# EAGLE schematic fmc (EAGLE 7.5.0)
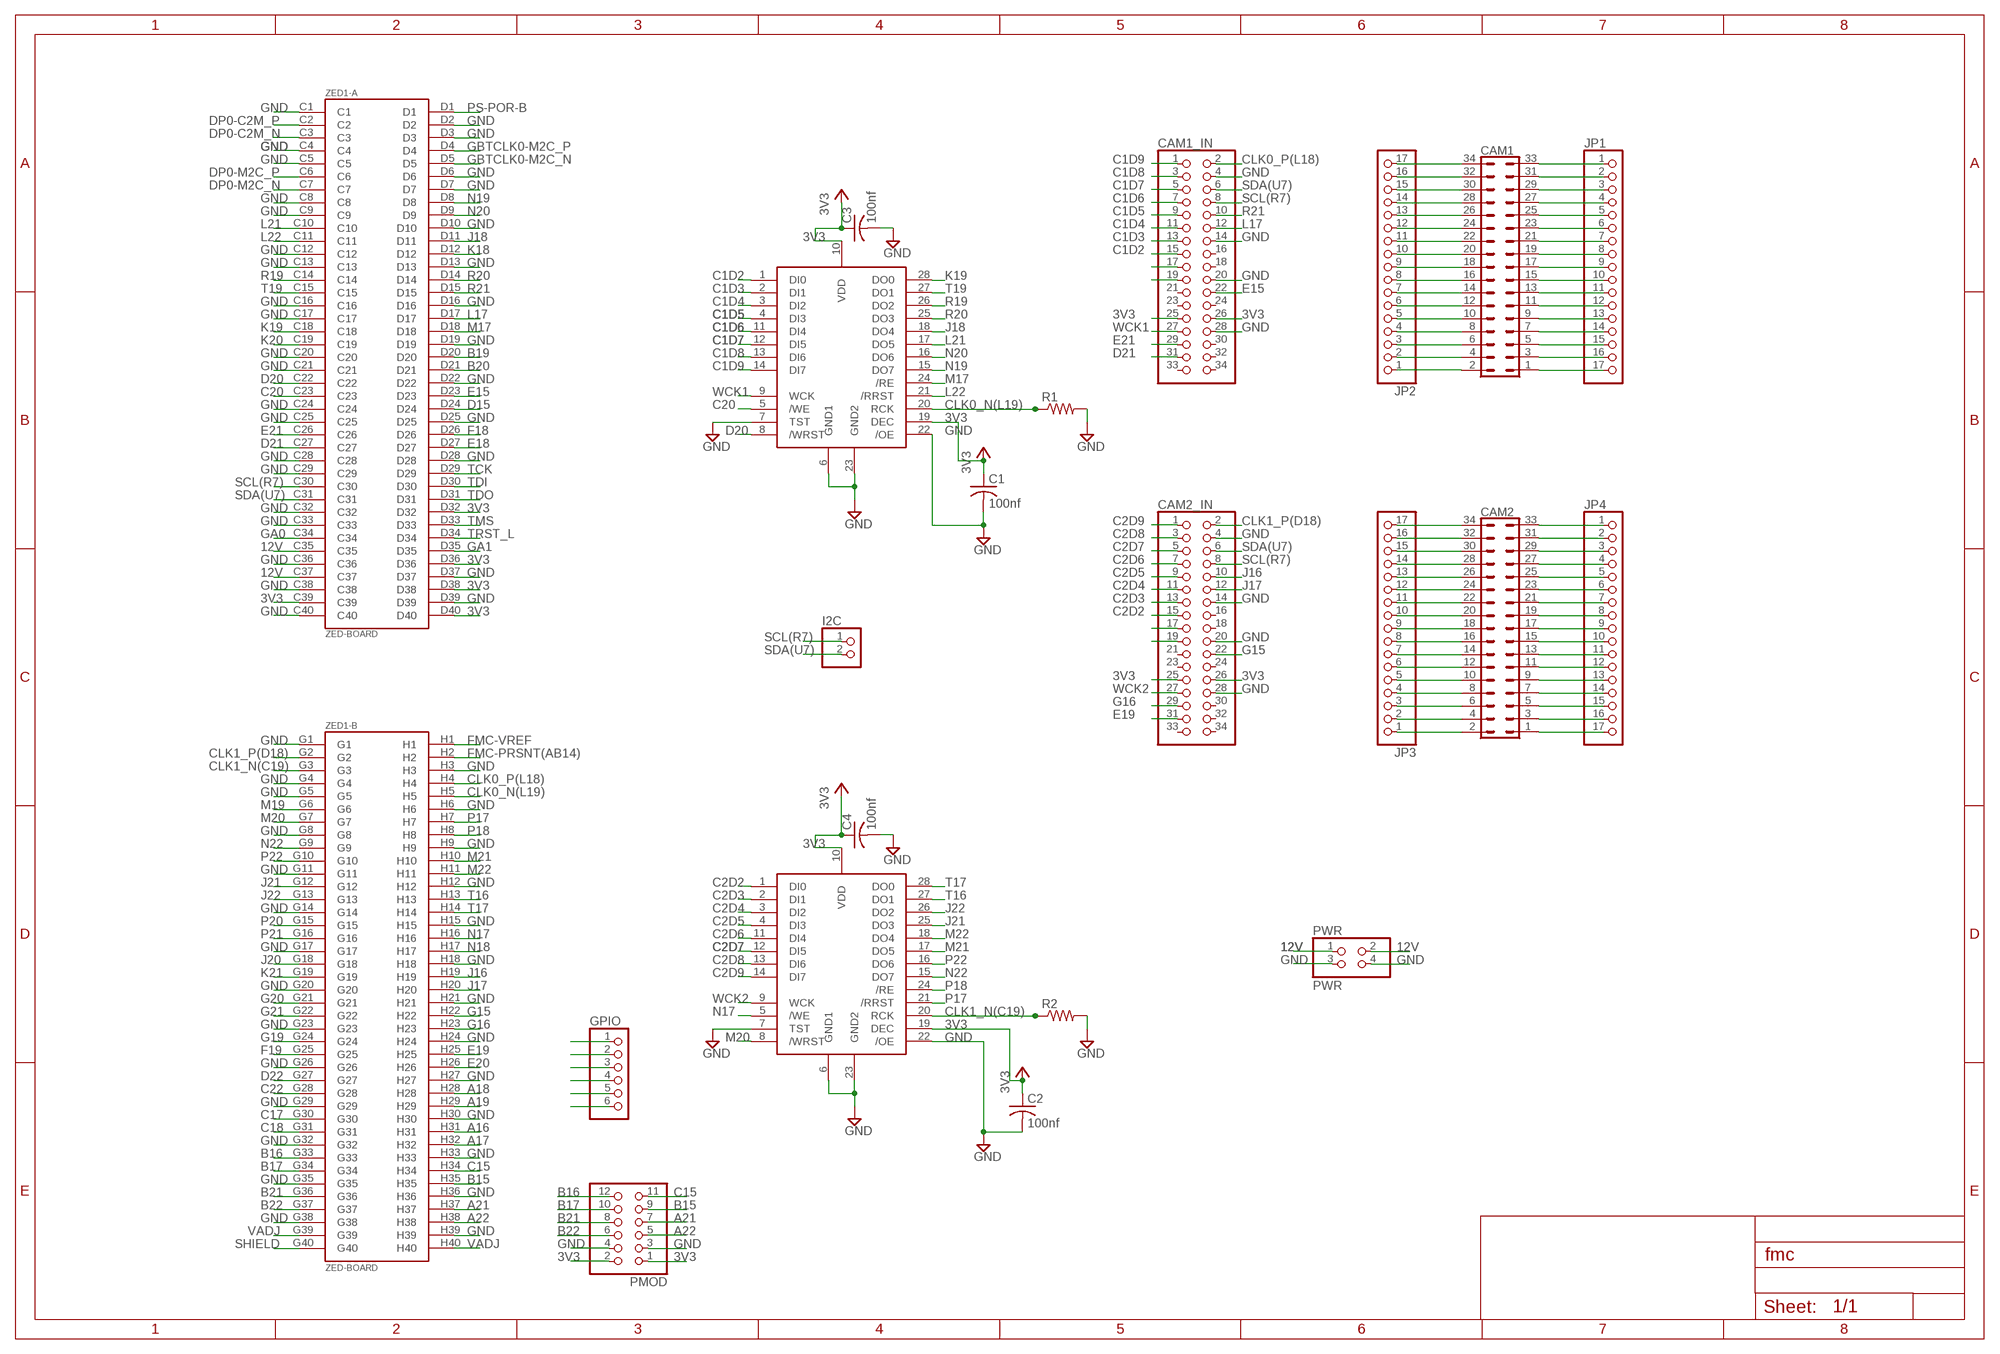
[diagram p0: schematic, sheet 1]

## Parts
AL422B_2  CAM2_FIFO  AL422B  [SOP28]
ALA22B_1  CAM1_FIFO  AL422B  [SOP28]
C1  100nf  C-US025-024X044  [C025-024X044]
C2  100nf  C-US025-024X044  [C025-024X044]
C3  100nf  C-US025-024X044  [C025-024X044]
C4  100nf  C-US025-024X044  [C025-024X044]
CAM1  PHB_1MM27_2X17_SNT  [PHB_1MM27_2X17_SNT]
CAM1_IN  PINHD-2X17  [2X17]
CAM2  PHB_1MM27_2X17_SNT  [PHB_1MM27_2X17_SNT]
CAM2_IN  PINHD-2X17  [2X17]
GPIO  PINHD-1X6  [1X06]
I2C  PINHD-1X2  [1X02]
JP1  PINHD-1X17  [1X17]
JP2  PINHD-1X17  [1X17]
JP3  PINHD-1X17  [1X17]
JP4  PINHD-1X17  [1X17]
PMOD  PINHD-2X6  [2X06]
PWR  PWR  PINHD-2X2  [2X02]
R1  R-US_M0805  [M0805]
R2  R-US_M0805  [M0805]
ZED1  ZED-BOARD  [ASP-134604-01]

## Nets
3V3: AL422B_2.10(VDD) AL422B_2.19(DEC) ALA22B_1.10(VDD) ALA22B_1.19(DEC) C1.1 C2.1 C3.1 C4.1 CAM1_IN.25 CAM1_IN.26 CAM2_IN.25 CAM2_IN.26 GPIO.6 PMOD.1 PMOD.2 ZED1.C39(-A:C39) ZED1.D32(-A:D32) ZED1.D36(-A:D36) ZED1.D38(-A:D38) ZED1.D40(-A:D40)
12V: PWR.1 PWR.2 ZED1.C35(-A:C35) ZED1.C37(-A:C37)
A16: GPIO.3 ZED1.H31(-B:H31)
A17: GPIO.4 ZED1.H32(-B:H32)
A18: GPIO.1 ZED1.H28(-B:H28)
A19: GPIO.2 ZED1.H29(-B:H29)
A21: PMOD.7 ZED1.H37(-B:H37)
A22: PMOD.5 ZED1.H38(-B:H38)
B15: PMOD.9 ZED1.H35(-B:H35)
B16: PMOD.12 ZED1.G33(-B:G33)
B17: PMOD.10 ZED1.G34(-B:G34)
B19: ZED1.D20(-A:D20)
B20: ZED1.D21(-A:D21)
B21: PMOD.8 ZED1.G36(-B:G36)
B22: PMOD.6 ZED1.G37(-B:G37)
C1D2: ALA22B_1.1(DI0) CAM1_IN.15
C1D3: ALA22B_1.2(DI1) CAM1_IN.13
C1D4: ALA22B_1.3(DI2) CAM1_IN.11
C1D5: ALA22B_1.4(DI3) CAM1_IN.9
C1D6: ALA22B_1.11(DI4) CAM1_IN.7
C1D7: ALA22B_1.12(DI5) CAM1_IN.5
C1D8: ALA22B_1.13(DI6) CAM1_IN.3
C1D9: ALA22B_1.14(DI7) CAM1_IN.1
C2D2: AL422B_2.1(DI0) CAM2_IN.15
C2D3: AL422B_2.2(DI1) CAM2_IN.13
C2D4: AL422B_2.3(DI2) CAM2_IN.11
C2D5: AL422B_2.4(DI3) CAM2_IN.9
C2D6: AL422B_2.11(DI4) CAM2_IN.7
C2D7: AL422B_2.12(DI5) CAM2_IN.5
C2D8: AL422B_2.13(DI6) CAM2_IN.3
C2D9: AL422B_2.14(DI7) CAM2_IN.1
C15: PMOD.11 ZED1.H34(-B:H34)
C17: ZED1.G30(-B:G30)
C18: ZED1.G31(-B:G31)
C20: ALA22B_1.5(/WE) ZED1.C23(-A:C23)
C22: ZED1.G28(-B:G28)
CLK0_N(L19): ALA22B_1.20(RCK) R1.1 ZED1.H5(-B:H5)
CLK0_P(L18): CAM1_IN.2 ZED1.H4(-B:H4)
CLK1_N(C19): AL422B_2.20(RCK) R2.1 ZED1.G3(-B:G3)
CLK1_P(D18): CAM2_IN.2 ZED1.G2(-B:G2)
D15: ZED1.D24(-A:D24)
D20: ALA22B_1.8(/WRST) ZED1.C22(-A:C22)
D21: CAM1_IN.31 ZED1.C27(-A:C27)
D22: ZED1.G27(-B:G27)
DP0-C2M_N: ZED1.C3(-A:C3)
DP0-C2M_P: ZED1.C2(-A:C2)
DP0-M2C_N: ZED1.C7(-A:C7)
DP0-M2C_P: ZED1.C6(-A:C6)
E15: CAM1_IN.22 ZED1.D23(-A:D23)
E18: ZED1.D27(-A:D27)
E19: CAM2_IN.31 ZED1.H25(-B:H25)
E20: ZED1.H26(-B:H26)
E21: CAM1_IN.29 ZED1.C26(-A:C26)
F18: ZED1.D26(-A:D26)
F19: ZED1.G25(-B:G25)
FMC-PRSNT(AB14): ZED1.H2(-B:H2)
FMC-VREF: ZED1.H1(-B:H1)
G15: CAM2_IN.22 ZED1.H22(-B:H22)
G16: CAM2_IN.29 ZED1.H23(-B:H23)
G19: ZED1.G24(-B:G24)
G20: ZED1.G21(-B:G21)
G21: ZED1.G22(-B:G22)
GA0: ZED1.C34(-A:C34)
GA1: ZED1.D35(-A:D35)
GBTCLK0-M2C_N: ZED1.D5(-A:D5)
GBTCLK0-M2C_P: ZED1.D4(-A:D4)
GND: AL422B_2.6(GND1) AL422B_2.7(TST) AL422B_2.22(/OE) AL422B_2.23(GND2) ALA22B_1.6(GND1) ALA22B_1.7(TST) ALA22B_1.22(/OE) ALA22B_1.23(GND2) C1.2 C2.2 C3.2 C4.2 CAM1_IN.4 CAM1_IN.14 CAM1_IN.20 CAM1_IN.28 CAM2_IN.4 CAM2_IN.14 CAM2_IN.20 CAM2_IN.28 GPIO.5 PMOD.3 PMOD.4 PWR.3 PWR.4 R1.2 R2.2 ZED1.C1(-A:C1) ZED1.C4(-A:C4) ZED1.C5(-A:C5) ZED1.C8(-A:C8) ZED1.C9(-A:C9) ZED1.C12(-A:C12) ZED1.C13(-A:C13) ZED1.C16(-A:C16) ZED1.C17(-A:C17) ZED1.C20(-A:C20) ZED1.C21(-A:C21) ZED1.C24(-A:C24) ZED1.C25(-A:C25) ZED1.C28(-A:C28) ZED1.C29(-A:C29) ZED1.C32(-A:C32) ZED1.C33(-A:C33) ZED1.C36(-A:C36) ZED1.C38(-A:C38) ZED1.C40(-A:C40) ZED1.D2(-A:D2) ZED1.D3(-A:D3) ZED1.D6(-A:D6) ZED1.D7(-A:D7) ZED1.D10(-A:D10) ZED1.D13(-A:D13) ZED1.D16(-A:D16) ZED1.D19(-A:D19) ZED1.D22(-A:D22) ZED1.D25(-A:D25) ZED1.D28(-A:D28) ZED1.D37(-A:D37) ZED1.D39(-A:D39) ZED1.G1(-B:G1) ZED1.G4(-B:G4) ZED1.G5(-B:G5) ZED1.G8(-B:G8) ZED1.G11(-B:G11) ZED1.G14(-B:G14) ZED1.G17(-B:G17) ZED1.G20(-B:G20) ZED1.G23(-B:G23) ZED1.G26(-B:G26) ZED1.G29(-B:G29) ZED1.G32(-B:G32) ZED1.G35(-B:G35) ZED1.G38(-B:G38) ZED1.H3(-B:H3) ZED1.H6(-B:H6) ZED1.H9(-B:H9) ZED1.H12(-B:H12) ZED1.H15(-B:H15) ZED1.H18(-B:H18) ZED1.H21(-B:H21) ZED1.H24(-B:H24) ZED1.H27(-B:H27) ZED1.H30(-B:H30) ZED1.H33(-B:H33) ZED1.H36(-B:H36) ZED1.H39(-B:H39)
J16: CAM2_IN.10 ZED1.H19(-B:H19)
J17: CAM2_IN.12 ZED1.H20(-B:H20)
J18: ALA22B_1.18(DO4) ZED1.D11(-A:D11)
J20: ZED1.G18(-B:G18)
J21: AL422B_2.25(DO3) ZED1.G12(-B:G12)
J22: AL422B_2.26(DO2) ZED1.G13(-B:G13)
K18: ZED1.D12(-A:D12)
K19: ALA22B_1.28(DO0) ZED1.C18(-A:C18)
K20: ZED1.C19(-A:C19)
K21: ZED1.G19(-B:G19)
L17: CAM1_IN.12 ZED1.D17(-A:D17)
L21: ALA22B_1.17(DO5) ZED1.C10(-A:C10)
L22: ALA22B_1.21(/RRST) ZED1.C11(-A:C11)
M17: ALA22B_1.24(/RE) ZED1.D18(-A:D18)
M19: ZED1.G6(-B:G6)
M20: AL422B_2.8(/WRST) ZED1.G7(-B:G7)
M21: AL422B_2.17(DO5) ZED1.H10(-B:H10)
M22: AL422B_2.18(DO4) ZED1.H11(-B:H11)
N17: AL422B_2.5(/WE) ZED1.H16(-B:H16)
N18: ZED1.H17(-B:H17)
N19: ALA22B_1.15(DO7) ZED1.D8(-A:D8)
N20: ALA22B_1.16(DO6) ZED1.D9(-A:D9)
N22: AL422B_2.15(DO7) ZED1.G9(-B:G9)
N$1: CAM1.34 JP2.17
N$2: CAM1.32 JP2.16
N$3: CAM1.30 JP2.15
N$4: CAM1.28 JP2.14
N$5: CAM1.26 JP2.13
N$6: CAM1.24 JP2.12
N$7: CAM1.22 JP2.11
N$8: CAM1.20 JP2.10
N$9: CAM1.18 JP2.9
N$10: CAM1.16 JP2.8
N$11: CAM1.14 JP2.7
N$12: CAM1.12 JP2.6
N$13: CAM1.10 JP2.5
N$14: CAM1.8 JP2.4
N$15: CAM1.6 JP2.3
N$16: CAM1.4 JP2.2
N$17: CAM1.2 JP2.1
N$18: CAM1.33 JP1.1
N$19: CAM1.31 JP1.2
N$21: CAM1.29 JP1.3
N$22: CAM1.27 JP1.4
N$23: CAM1.25 JP1.5
N$24: CAM1.23 JP1.6
N$25: CAM1.21 JP1.7
N$26: CAM1.19 JP1.8
N$27: CAM1.17 JP1.9
N$28: CAM1.15 JP1.10
N$29: CAM1.13 JP1.11
N$30: CAM1.11 JP1.12
N$31: CAM1.9 JP1.13
N$32: CAM1.7 JP1.14
N$33: CAM1.5 JP1.15
N$34: CAM1.3 JP1.16
N$35: CAM1.1 JP1.17
N$36: CAM2.33 JP4.1
N$37: CAM2.31 JP4.2
N$38: CAM2.29 JP4.3
N$39: CAM2.27 JP4.4
N$40: CAM2.25 JP4.5
N$41: CAM2.23 JP4.6
N$42: CAM2.21 JP4.7
N$43: CAM2.19 JP4.8
N$44: CAM2.17 JP4.9
N$45: CAM2.15 JP4.10
N$46: CAM2.13 JP4.11
N$47: CAM2.11 JP4.12
N$48: CAM2.9 JP4.13
N$49: CAM2.7 JP4.14
N$50: CAM2.5 JP4.15
N$51: CAM2.3 JP4.16
N$52: CAM2.1 JP4.17
N$53: CAM2.34 JP3.17
N$54: CAM2.32 JP3.16
N$55: CAM2.30 JP3.15
N$56: CAM2.28 JP3.14
N$57: CAM2.26 JP3.13
N$58: CAM2.24 JP3.12
N$59: CAM2.22 JP3.11
N$60: CAM2.20 JP3.10
N$61: CAM2.18 JP3.9
N$62: CAM2.16 JP3.8
N$63: CAM2.14 JP3.7
N$64: CAM2.12 JP3.6
N$65: CAM2.10 JP3.5
N$66: CAM2.8 JP3.4
N$67: CAM2.6 JP3.3
N$68: CAM2.4 JP3.2
N$69: CAM2.2 JP3.1
N$94: CAM1_IN.19
N$95: CAM1_IN.17
N$128: CAM2_IN.19
N$129: CAM2_IN.17
P17: AL422B_2.21(/RRST) ZED1.H7(-B:H7)
P18: AL422B_2.24(/RE) ZED1.H8(-B:H8)
P20: ZED1.G15(-B:G15)
P21: ZED1.G16(-B:G16)
P22: AL422B_2.16(DO6) ZED1.G10(-B:G10)
PS-POR-B: ZED1.D1(-A:D1)
R19: ALA22B_1.26(DO2) ZED1.C14(-A:C14)
R20: ALA22B_1.25(DO3) ZED1.D14(-A:D14)
R21: CAM1_IN.10 ZED1.D15(-A:D15)
SCL(R7): CAM1_IN.8 CAM2_IN.8 I2C.1 ZED1.C30(-A:C30)
SDA(U7): CAM1_IN.6 CAM2_IN.6 I2C.2 ZED1.C31(-A:C31)
SHIELD: ZED1.G40(-B:G40)
T16: AL422B_2.27(DO1) ZED1.H13(-B:H13)
T17: AL422B_2.28(DO0) ZED1.H14(-B:H14)
T19: ALA22B_1.27(DO1) ZED1.C15(-A:C15)
TCK: ZED1.D29(-A:D29)
TDI: ZED1.D30(-A:D30)
TDO: ZED1.D31(-A:D31)
TMS: ZED1.D33(-A:D33)
TRST_L: ZED1.D34(-A:D34)
VADJ: ZED1.G39(-B:G39) ZED1.H40(-B:H40)
WCK1: ALA22B_1.9(WCK) CAM1_IN.27
WCK2: AL422B_2.9(WCK) CAM2_IN.27
Unconnected: CAM1_IN.16 CAM1_IN.18 CAM1_IN.21 CAM1_IN.23 CAM1_IN.24 CAM1_IN.30 CAM1_IN.32 CAM1_IN.33 CAM1_IN.34 CAM2_IN.16 CAM2_IN.18 CAM2_IN.21 CAM2_IN.23 CAM2_IN.24 CAM2_IN.30 CAM2_IN.32 CAM2_IN.33 CAM2_IN.34

## Library data of the parts
AL422B_2 ALA22B_1 = AL422B:AL422B: Averlogic AL422B 3Mbit FIFO
C1-C4 = rcl:C-US: CAPACITOR, American symbol
CAM1 CAM2 = _hhn_con_pinhead_box_1mm27:PHB_1MM27_2X17_*: Pin Header Box-Type, 1.27mm/0.5"/50mil Pitch, 2x17 Circuits Note: see library description for an important note about THT-version
CAM1_IN CAM2_IN = pinhead:PINHD-2X17: PIN HEADER
GPIO = pinhead:PINHD-1X6: PIN HEADER
I2C = pinhead:PINHD-1X2: PIN HEADER
JP1-JP4 = pinhead:PINHD-1X17: PIN HEADER
PMOD = pinhead:PINHD-2X6: PIN HEADER
PWR = pinhead:PINHD-2X2: PIN HEADER
R1 R2 = resistor:R-US_: RESISTOR, American symbol
ZED1 = zed-board:ZED-BOARD